# EAGLE design snarfbasev4b (EAGLE 6.4)
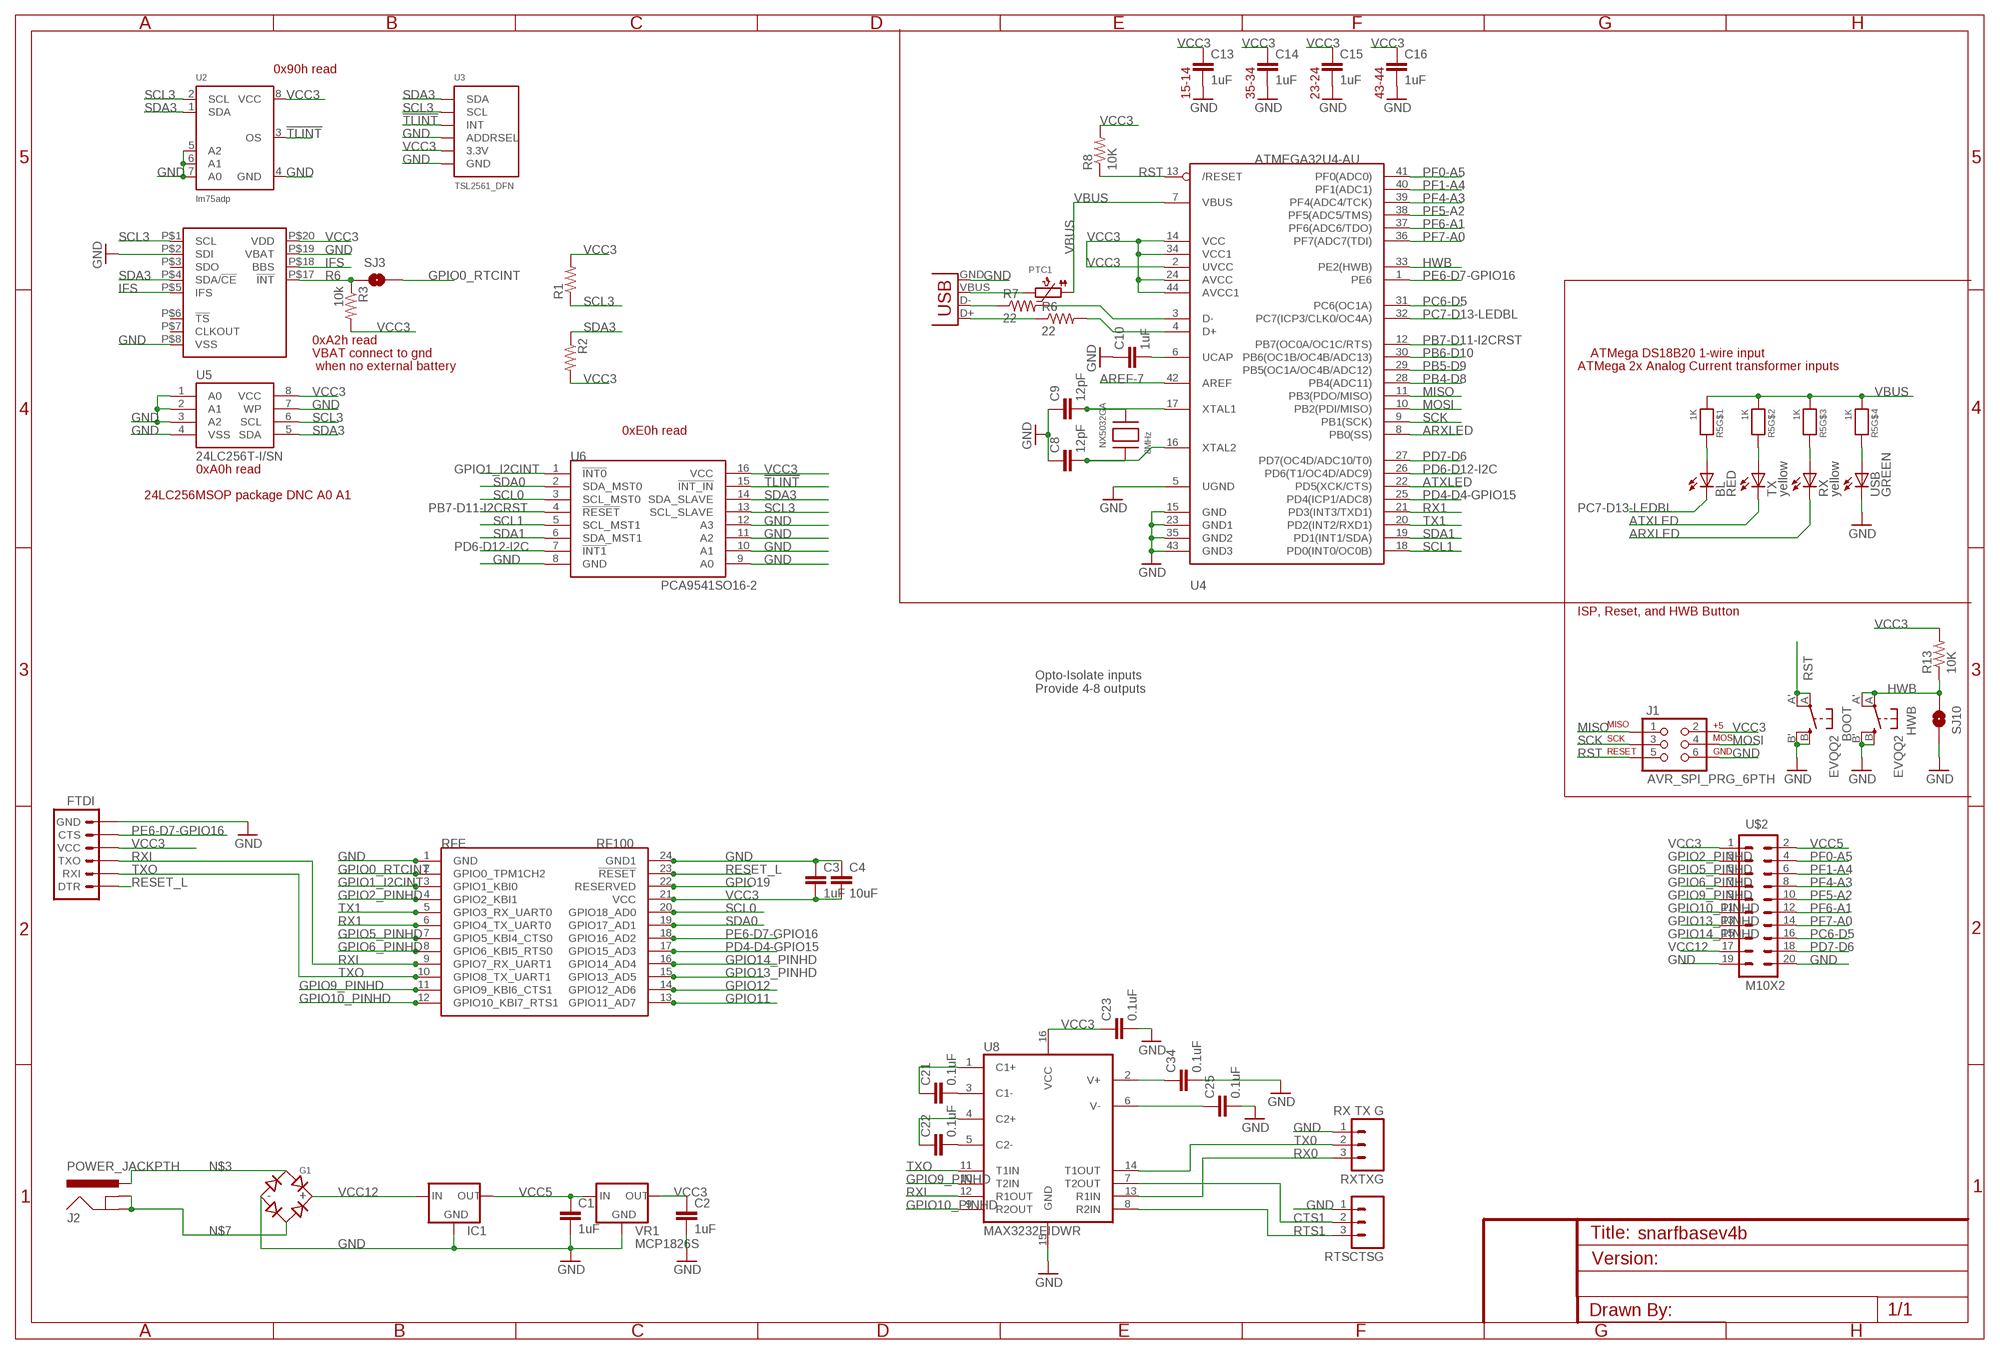
[diagram p0: schematic, sheet 1]

## Parts
BL  RED  LED0603  [LED-0603]
BOOT  EVQQ2  [EVQ-Q2]
C1  1uF  CAP0805  [0805]
C2  1uF  CAP0805  [0805]
C3  1uF  CAP0805  [0805]
C4  10uF  CAP0805  [0805]
C8  12pF  CAP0603-CAP  [0603-CAP]
C9  12pF  CAP0603-CAP  [0603-CAP]
C10  1uF  CAP0805  [0805]
C13  1uF  CAP0805  [0805]
C14  1uF  CAP0805  [0805]
C15  1uF  CAP0805  [0805]
C16  1uF  CAP0805  [0805]
C21  0.1uF  CAP0805  [0805]
C22  0.1uF  CAP0805  [0805]
C23  0.1uF  CAP0805  [0805]
C25  0.1uF  CAP0805  [0805]
C34  0.1uF  CAP0805  [0805]
FTDI  ARDUINO_SERIAL_PROGRAMPTH  [1X06]
G1  BRIDGERECTIFIER  [SOIC-4]
HWB  EVQQ2  [EVQ-Q2]
IC1  V_REG_78XXMURATA  [TO220-MURATA]
J1  AVR_SPI_PRG_6PTH  [2X3]
J2  POWER_JACKPTH  [POWER_JACK_PTH]
NX5032GA  8MHz  XTALNX5032  [NX5032]
PTC1  PTC1206  [1206]
R1  RESISTOR0805-RES  [0805]
R2  RESISTOR0805-RES  [0805]
R3  10k  RESISTOR  [0805]
R5  1K  RESISTOR_4PACK  [RESPACK_4X0603]
R6  22  RESISTOR0603-RES  [0603-RES]
R7  22  RESISTOR0603-RES  [0603-RES]
R8  10K  RESISTOR0805-RES  [0805]
R13  10K  RESISTOR0805-RES  [0805]
RFE  RFE  RF100-JACKJACK2  [SYNAPSERFENGINE-THM-SMT-JACK2]
RTSCTSG  M03PTH  [1X03]
RX  yellow  LED0603  [LED-0603]
RXTXG  RX TX G  M03PTH  [1X03]
SJ3  SOLDERJUMPERNC2  [SJ_2S-NOTRACE]
SJ10  HWB  SOLDERJUMPERNO  [SJ_2S-NO]
TX  yellow  LED0603  [LED-0603]
U1  PCF2129ASO20  [SO20W]
U2  lm75adp  TEMP_LM75B  [TSSOP8]
U3  TSL2561_DFN  LIGHT_TSL2561  [TSL2561_FN]
U4  ATMEGA32U4-AU  [TQFP44]
U5  24LC256T-I/SN  EEPROM-I2CSMD  [SO08]
U6  PCA9541SO16-2  [SOIC16]
U8  MAX3232EIDWR  MAX232SOIC16  [SO016]
U$2  M10X2  [2X10]
USB  GREEN  LED0603  [LED-0603]
VR1  MCP1826S  V_REG_MIC2920  [SOT223]
X1  USBSMD  USBH2959CT-ND  [USB-MINIB]

## Nets
!TLINT: U2.3(OS) U3.INT U6.15(!INT_IN)
AREF-7: U4.42(AREF)
ARXLED [smallsignal]: RX.C U4.8(PB0(SS))
ATXLED [smallsignal]: TX.C U4.22(PD5(XCK/CTS))
CTS1 [smallsignal]: RTSCTSG.2 U8.7(T2OUT)
GND: BOOT.B'(S1) BOOT.B(S) C1.2 C2.2 C3.1 C4.1 C8.1 C9.1 C10.1 C13.2 C14.2 C15.2 C16.2 C23.2 C25.2 C34.2 FTDI.6(GND) G1.- HWB.B'(S1) HWB.B(S) IC1.GND J1.6 RFE.1(GND) RFE.24(GND1) RFE.P1 RFE.P24 RFE.P201 RFE.P224 RTSCTSG.1 RXTXG.1 SJ10.2 U1.P$2(SDI) U1.P$8(VSS) U1.P$19(VBAT) U2.4(GND) U2.5(A2) U2.6(A1) U2.7(A0) U3.ADR(ADDRSEL) U3.VSS(GND) U4.5(UGND) U4.15(GND) U4.23(GND1) U4.35(GND2) U4.43(GND3) U5.1(A0) U5.2(A1) U5.3(A2) U5.4(VSS) U5.7(WP) U6.8(GND) U6.9(A0) U6.10(A1) U6.11(A2) U6.12(A3) U8.15(GND) U$2.19 U$2.20 USB.C VR1.2(GND) VR1.4(GND) X1.GND
GPIO0_RTCINT [smallsignal]: RFE.2(GPIO0_TPM1CH2) RFE.P2 RFE.P202 SJ3.2
GPIO1_I2CINT [smallsignal]: RFE.3(GPIO1_KBI0) RFE.P3 RFE.P203 U6.1(!INT0)
GPIO2_PINHD [smallsignal]: RFE.4(GPIO2_KBI1) RFE.P4 RFE.P204 U$2.3
GPIO5_PINHD [smallsignal]: RFE.7(GPIO5_KBI4_CTS0) RFE.P7 RFE.P207 U$2.5
GPIO6_PINHD [smallsignal]: RFE.8(GPIO6_KBI5_RTS0) RFE.P8 RFE.P208 U$2.7
GPIO9_PINHD: RFE.11(GPIO9_KBI6_CTS1) RFE.P11 RFE.P211 U8.10(T2IN) U$2.9
GPIO10_PINHD: RFE.12(GPIO10_KBI7_RTS1) RFE.P12 RFE.P212 U8.9(R2OUT) U$2.11
GPIO11 [smallsignal]: RFE.13(GPIO11_AD7) RFE.P13 RFE.P213
GPIO12 [smallsignal]: RFE.14(GPIO12_AD6) RFE.P14 RFE.P214
GPIO13_PINHD [smallsignal]: RFE.15(GPIO13_AD5) RFE.P15 RFE.P215 U$2.13
GPIO14_PINHD [smallsignal]: RFE.16(GPIO14_AD4) RFE.P16 RFE.P216 U$2.15
GPIO19: RFE.22(RESERVED) RFE.P22 RFE.P222
HWB [smallsignal]: HWB.A'(P1) HWB.A(P) R13.1 SJ10.1 U4.33(PE2(HWB))
IFS: U1.P$5(IFS) U1.P$18(BBS)
MISO [smallsignal]: J1.1 U4.11(PB3(PDO/MISO))
MOSI [smallsignal]: J1.4 U4.10(PB2(PDI/MISO))
N$3 [Power]: G1.~1(AC1) J2.PWR
N$4: C10.2 U4.6(UCAP)
N$5: BL.A R5.8
N$7 [Power]: G1.~2(AC2) J2.GND J2.GNDBREAK
N$8: R5.7 TX.A
N$9: R5.6 RX.A
N$10: R5.5 USB.A
N$13: C21.2 U8.3(C1-)
N$14: C22.2 U8.5(C2-)
N$15: C34.1 U8.2(V+)
N$16: C25.1 U8.6(V-)
N$17: C21.1 U8.1(C1+)
N$18: C22.1 U8.4(C2+)
PB4-D8 [smallsignal]: U4.28(PB4(ADC11))
PB5-D9 [smallsignal]: U4.29(PB5(OC1A/OC4B/ADC12))
PB6-D10 [smallsignal]: U4.30(PB6(OC1B/OC4B/ADC13))
PB7-D11-I2CRST [smallsignal]: U4.12(PB7(OC0A/OC1C/RTS)) U6.4(!RESET)
PC6-D5 [smallsignal]: U4.31(PC6(OC1A)) U$2.16
PC7-D13-LEDBL [smallsignal]: BL.C U4.32(PC7(ICP3/CLK0/OC4A))
PD4-D4-GPIO15 [smallsignal]: RFE.17(GPIO15_AD3) RFE.P17 RFE.P217 U4.25(PD4(ICP1/ADC8))
PD6-D12-I2C [smallsignal]: U4.26(PD6(T1/OC4D/ADC9)) U6.7(!INT1)
PD7-D6 [smallsignal]: U4.27(PD7(OC4D/ADC10/T0)) U$2.18
PE6-D7-GPIO16 [smallsignal]: FTDI.5(CTS) RFE.18(GPIO16_AD2) RFE.P18 RFE.P218 U4.1(PE6)
PF0-A5 [smallsignal]: U4.41(PF0(ADC0)) U$2.4
PF1-A4 [smallsignal]: U4.40(PF1(ADC1)) U$2.6
PF4-A3 [smallsignal]: U4.39(PF4(ADC4/TCK)) U$2.8
PF5-A2 [smallsignal]: U4.38(PF5(ADC5/TMS)) U$2.10
PF6-A1 [smallsignal]: U4.37(PF6(ADC6/TDO)) U$2.12
PF7-A0 [smallsignal]: U4.36(PF7(ADC7(TDI)) U$2.14
R6: R3.1 SJ3.1 U1.P$17(!INT)
RESET_L [smallsignal]: FTDI.1(DTR) RFE.23(!RESET) RFE.P23 RFE.P223
RST [smallsignal]: BOOT.A'(P1) BOOT.A(P) J1.5 R8.1 U4.13(/RESET)
RTS1 [smallsignal]: RTSCTSG.3 U8.8(R2IN)
RX0: RXTXG.3 U8.13(R1IN)
RX1 [smallsignal]: RFE.6(GPIO4_TX_UART0) RFE.P6 RFE.P206 U4.21(PD3(INT3/TXD1))
RXI [smallsignal]: FTDI.3(TXO) RFE.9(GPIO7_RX_UART1) RFE.P9 RFE.P209 U8.12(R1OUT)
SCK [smallsignal]: J1.3 U4.9(PB1(SCK))
SCL0: RFE.20(GPIO18_AD0) RFE.P20 RFE.P220 U6.3(SCL_MST0)
SCL1 [smallsignal]: U4.18(PD0(INT0/OC0B)) U6.5(SCL_MST1)
SCL3 [smallsignal]: R1.1 U1.P$1(SCL) U2.2(SCL) U3.CLK(SCL) U5.6(SCL) U6.13(SCL_SLAVE)
SDA0: RFE.19(GPIO17_AD1) RFE.P19 RFE.P219 U6.2(SDA_MST0)
SDA1 [smallsignal]: U4.19(PD1(INT1/SDA)) U6.6(SDA_MST1)
SDA3 [smallsignal]: R2.1 U1.P$4(SDA/!CE) U2.1(SDA) U3.DATA(SDA) U5.5(SDA) U6.14(SDA_SLAVE)
TX0: RXTXG.2 U8.14(T1OUT)
TX1 [smallsignal]: RFE.5(GPIO3_RX_UART0) RFE.P5 RFE.P205 U4.20(PD2(INT2/RXD1))
TXO [smallsignal]: FTDI.2(RXI) RFE.10(GPIO8_TX_UART1) RFE.P10 RFE.P210 U8.11(T1IN)
UD_N: R7.2 U4.3(D-)
UD_P: R6.2 U4.4(D+)
UDM_N: R7.1 X1.D-
UDM_P: R6.1 X1.D+
VBUS: PTC1.1 R5.1 R5.2 R5.3 R5.4 U4.7(VBUS)
VBUSRAW: PTC1.2 X1.VBUS
VCC3: C2.1 C3.2 C4.2 C13.1 C14.1 C15.1 C16.1 C23.1 FTDI.4(VCC) J1.2 R1.2 R2.2 R3.2 R8.2 R13.2 RFE.21(VCC) RFE.P21 RFE.P221 U1.P$20(VDD) U2.8(VCC) U3.VDD(3.3V) U4.2(UVCC) U4.14(VCC) U4.24(AVCC) U4.34(VCC1) U4.44(AVCC1) U5.8(VCC) U6.16(VCC) U8.16(VCC) U$2.1 VR1.3(OUT)
VCC5 [Power]: C1.1 IC1.OUT U$2.2 VR1.1(IN)
VCC12 [Power]: G1.+ IC1.IN U$2.17
XTAL_N [smallsignal]: C9.2 NX5032GA.P$2 U4.17(XTAL1)
XTAL_P [smallsignal]: C8.2 NX5032GA.P$1 U4.16(XTAL2)
Unconnected: U1.P$3(SDO) U1.P$6(!TS) U1.P$7(CLKOUT)

## Notes on the sheet
- 0x90h read
- 15-14 | 35-34 | 23-24 | 43-44
- 0xA2h read
- VBAT connect to gnd | ATMega DS18B20 1-wire input
- when no external battery | ATMega 2x Analog Current transformer inputs
- 0xE0h read
- 0xA0h read
- 24LC256MSOP package DNC A0 A1
- ISP, Reset, and HWB Button
- Opto-Isolate inputs
  Provide 4-8 outputs

## Library data of the parts
BL RX TX USB = 0_jc-custom:LED: LEDs Standard schematic elements and footprints for 5mm, 3mm, 1206, and 0603 sized LEDs. 5mm - Spark Fun Electronics SKU : COM-00529 (and others)
BOOT HWB = adaprog:EVQQ2
C1-C4 C10 C13-C16 C21-C23 C25 C34 = 0_jc-custom:CAP: Capacitor Standard 0603 ceramic capacitor, and 0.1" leaded capacitor.
C8 C9 = SparkFun:CAP: Capacitor Standard 0603 ceramic capacitor, and 0.1" leaded capacitor.
FTDI = SparkFun:ARDUINO_SERIAL_PROGRAM
G1 = microbuilder:BRIDGERECTIFIER: Bridge Rectifier SOIC-4: Comchip B4S-G - 400V 800mA, Peak Vf 1.1V (Digikey: 641-1334-1-ND)
IC1 = 0_jc-custom-eagle6:V_REG_78XX: Voltage Regulator Standard 7805 5V regulator. IGO (Input Ground Output). Spark Fun Electronics SKU : COM-00107
J1 = SparkFun:AVR_SPI_PRG_6: AVR ISP 6 Pin This is the reduced ISP connector for AVR programming. Common on Arduino. This footprint will take up less PCB space and can be used with a 10-pin to 6-pin adapter such as SKU: BOB-08508
J2 = SparkFun-Connectors:POWER_JACK: Power Jack This is the standard 5.5mm barrel jack for power. The PTH is the most common, proven, reliable, footprint. The Slot footprint only works if the mill layer is transmitted to the PCB fab house so be warned. Mating wall wart : TOL-00298 (and others); PROD_ID: PRT-00119
NX5032GA = adafruit:XTAL: Low cost SMT crystals, no capacitors included http://www.ladyada.net/library/eagle
PTC1 = microbuilder:PTC: PTC (Resettable Fuse) 1206 Package 250mA PTC (16V Max, Time-to-Trip: 0.08s) - Digikey: F2110CT-ND 1210 Package 100mA PTC (30V Max, Time-to-Trip: 0.6s) - Digikey: MF-USMF010-2CT-ND 1812 Package 750mA PTC (24V Max, Time-to-Trip: 0.2s) - Digikey: MF-MSMF075/24-2CT-ND
R1 R2 R8 R13 = SparkFun-Resistors:RESISTOR: Resistor
R3 = SparkFun:RESISTOR: Resistor
R5 = microbuilder:RESISTOR_4PACK: Resistor Packs (4 resistors) 4 x 0603 10K 1/16W - Digikey: YC164J-10KCT-ND
R6 R7 = 0_jc-custom:RESISTOR
RFE = 0_jc-custom:RF100-JACK
RTSCTSG RXTXG = SparkFun:M03: Header 3 Standard 3-pin 0.1" header. Use with straight break away headers (SKU : PRT-00116), right angle break away headers (PRT-00553), swiss pins (PRT-00743), machine pins (PRT-00117), and female headers (PRT-00115). Molex polarized connector foot print use with SKU : PRT-08232 with associated crimp pins and housings.
SJ3 SJ10 = SparkFun:SOLDERJUMPER: Solder Jumper Standard SMD solder jumper. Used to automate production. Two varients : Normally Open and Normally Closed are the same, but have different paste layers. NC will have a large amount of paste and should jumper during reflow.
U1 = 0_jc-custom:PCF2129A
U2 = microbuilder:TEMP_LM75B: LM75B I2C Temperature Sensor The I2C-based LM75B can measure temperature between -55 and 125°C in 0.125°C increments (11-bit resolution). Digikey: 568-4768-1-ND For a 1.8V compatible part, look at the following pin and SW compatible parts: DS75LV - Mouser: 700-DS75LVS, Digikey: (TSSOP8) DS75LVU+-ND (SOIC8) DS75LVS+-ND
U3 = microbuilder:LIGHT_TSL2561: TSL2561 Light-To-Digital Sensor Mouser Part Numbers: CS (obsolete): 856-TSL2561CS DFN (cheapest): 856-TSL2561FN
U4 = adafruit:ATMEGA32U4: http://www.ladyada.net/library/eagle
U5 = SparkFun:EEPROM-I2C
U6 = 0_jc-custom-eagle6:PCA9541
U8 = SparkFun:MAX232: RS232 Transceiver Very common IC. This is generically called 'MAX232', but works with the 3V equivalent MAX3232 generic ICs. Field tested and mother approved. Spark Fun Electronics SKU : COM-00316 (DIP) and COM-00589 (SMD)
U$2 = SparkFun-Connectors:M10X2: This was SPECIALLY designed to be used with our Graphic LCD Backpack. Be sure you want to use this! It is not only staggered on each line of header holes, but IT IS ALSO offset of the center point of the top and bottom lines by 5 mil. This causes the headers to lock into place on the "standard" footprint on the LCD screen. The extra squares on the tdocu layer are there simply to reference other pins (if you were to actually populate a longer header than ten long - this is what we do with the backpacks).
VR1 = SparkFun-PowerIC:V_REG_MIC2920: MIC2920A (http://www.micrel.com/_PDF/mic2920.pdf) - 400mA output LDO Regulator
X1 = 0_jc-custom:USB: USB Connectors Fully proven 670-1190-1-ND http://search.digikey.com/scripts/DkSearch/dksus.dll?Detail&name=670-1190-1-ND

## Net classes
0 default: width 0.254 mm
1 smallsignal: width 0.152 mm
2 Power: width 0.508 mm
3 medsignal: width 0.203 mm

## Board
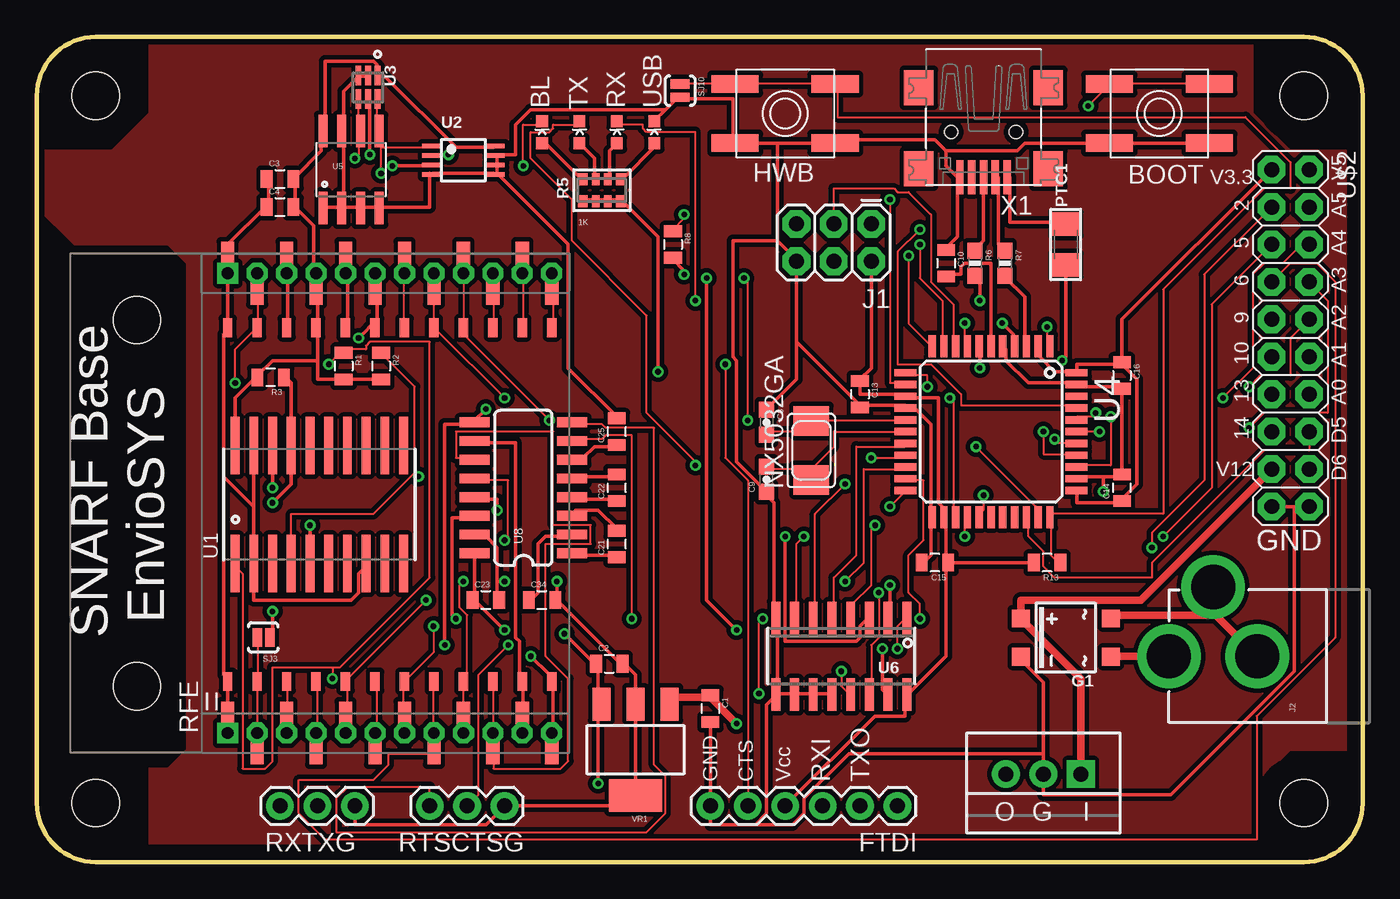
[diagram p1: board, top side]
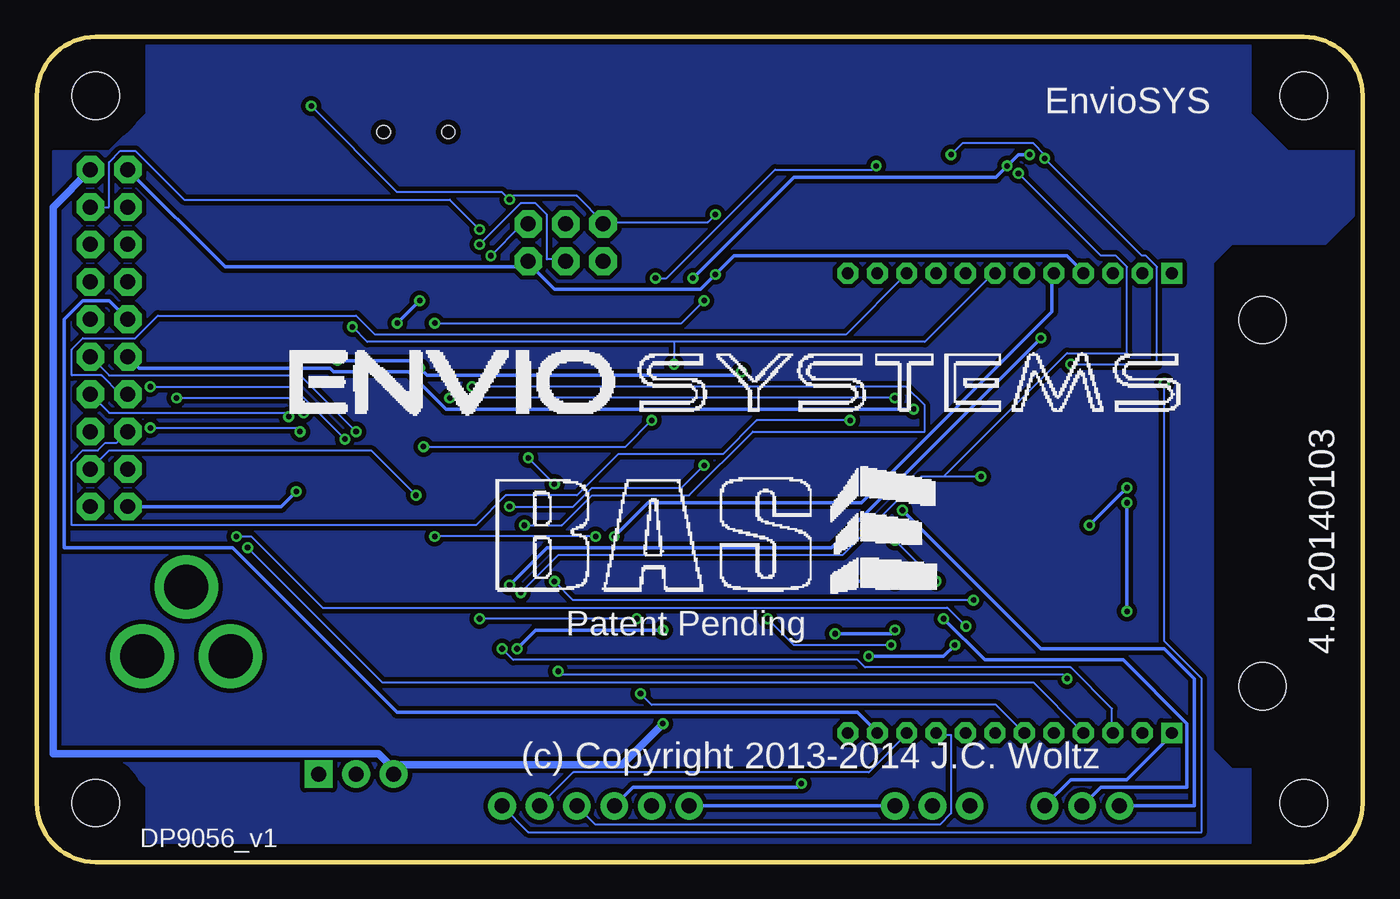
[diagram p2: board, bottom side, seen from below]

Size 90 x 56 mm. Coordinates in mm from the lower left corner, seen from the top.
Outline: 4,0 86,0 arc90 90,4 90,52 arc90 86,56 4,56 arc90 0,52 0,4 arc90 4,0
Copper layers (1*16): Top 0.0356mm / dielectric 1.5011mm / Bottom 0.0356mm
Design rules "LaenPCBOrder-JCModified *": minimum track width 6mil, minimum drill 15mil, track to track 6mil, track to pad 6mil, pad to pad 6mil, via to via 6mil, smd to smd 6mil, copper to edge 15mil, drill to drill 6mil, minimum pad ring 12mil, minimum via ring 7mil, stop-mask expansion 4mil, vias tented up to drill 25mil, thermal gap 10mil

### Footprints (pad centres in the part's own frame; a part is rotated, then mirrored left to right if it is on the bottom)
LED-0603 = smd 0.8 x 0.8: A 0,-0.75; C 0,0.75
EVQ-Q2 = smd 3.2 x 1.2: A -3.4,-2; A' 3.4,-2; B -3.4,2; B' 3.4,2
0805 = smd 0.8 x 1.2: 1 -0.9,0; 2 0.9,0
0603-CAP = smd 1.1 x 1: 1 -0.85,0; 2 0.85,0
1X06 = drill 1.016 pad 1.88: 1 0,0; 2 2.54,0; 3 5.08,0; 4 7.62,0; 5 10.16,0; 6 12.7,0
SOIC-4 = smd 1.2 x 1.2: + 1.3,3.05; - -1.3,3.05; ~1 -1.3,-3.05; ~2 1.3,-3.05
TO220-MURATA = drill 1 pad 1.88: GND 0,0; OUT 2.54,0 | drill 1 pad 1.88 square: IN -2.54,0
2X3 = drill 1.016 pad 1.88 octagon: 1 0,0; 2 0,2.54; 3 2.54,0; 4 2.54,2.54; 5 5.08,0; 6 5.08,2.54
POWER_JACK_PTH = drill 2.997 pad 4.318: GND 0,7.7; GNDBREAK 4.7,10.7; PWR 0,13.7
NX5032 = smd 2 x 2.4: P$1 2,0; P$2 -2,0
1206 = smd 1.6 x 1.8: 1 -1.4,0; 2 1.4,0
RESPACK_4X0603 = smd 0.65 x 0.8: 1 -1.3,-0.75; 4 1.3,-0.75; 5 1.3,0.75; 8 -1.3,0.75 | smd 0.5 x 0.8: 2 -0.4,-0.75; 3 0.4,-0.75; 6 0.4,0.75; 7 -0.4,0.75
0603-RES = smd 1.1 x 1: 1 -0.85,0; 2 0.85,0
SYNAPSERFENGINE-THM-SMT-JACK2 = drill 0.8 square: 1 0,0; 24 31.2,0 | drill 0.8 pad 1.422 octagon: 2 0,-2; 3 0,-4; 4 0,-6; 5 0,-8; 6 0,-10; 7 0,-12; 8 0,-14; 9 0,-16; 10 0,-18; 11 0,-20; 12 0,-22; 13 31.2,-22; 14 31.2,-20; 15 31.2,-18; 16 31.2,-16; 17 31.2,-14; 18 31.2,-12; 19 31.2,-10; 20 31.2,-8; 21 31.2,-6; 22 31.2,-4; 23 31.2,-2 | smd 1.67 x 0.89: P1 1.3,0; P2 -1.3,-2; P3 1.3,-4; P4 -1.3,-6; P5 1.3,-8; P6 -1.3,-10; P7 1.3,-12; P8 -1.3,-14; P9 1.3,-16; P10 -1.3,-18; P11 1.3,-20; P12 -1.3,-22; P13 29.9,-22; P14 32.5,-20; P15 29.9,-18; P16 32.5,-16; P17 29.9,-14; P18 32.5,-12; P19 29.9,-10; P20 32.5,-8; P21 29.9,-6; P22 32.5,-4; P23 29.9,-2; P24 32.5,0 | smd 1.27 x 0.635: P201 3.5,0; P202 3.5,-2; P203 3.5,-4; P204 3.5,-6; P205 3.5,-8; P206 3.5,-10; P207 3.5,-12; P208 3.5,-14; P209 3.5,-16; P210 3.5,-18; P211 3.5,-20; P212 3.5,-22; P213 27.5,-22; P214 27.5,-20; P215 27.5,-18; P216 27.5,-16; P217 27.5,-14; P218 27.5,-12; P219 27.5,-10; P220 27.5,-8; P221 27.5,-6; P222 27.5,-4; P223 27.5,-2; P224 27.5,0 | hole 3.2: 3.17,6.16; 28.03,6.16
1X03 = drill 1.016 pad 1.88: 1 0,0; 2 2.54,0; 3 5.08,0
SJ_2S-NOTRACE = smd 0.635 x 1.27: 1 -0.45,0; 2 0.4,0
SJ_2S-NO = smd 0.635 x 1.27: 1 -0.45,0; 2 0.45,0
SO20W = smd 0.6 x 3.9: P$1 -5.715,-4; P$2 -4.445,-4; P$3 -3.175,-4; P$4 -1.905,-4; P$5 -0.635,-4; P$6 0.635,-4; P$7 1.905,-4; P$8 3.175,-4; P$9 4.445,-4; P$10 5.715,-4; P$11 5.715,4; P$12 4.445,4; P$13 3.175,4; P$14 1.905,4; P$15 0.635,4; P$16 -0.635,4; P$17 -1.905,4; P$18 -3.175,4; P$19 -4.445,4; P$20 -5.715,4
TSSOP8 = smd 1.2 x 0.305: 1 -2.2,0.975; 2 -2.2,0.325; 3 -2.2,-0.325; 4 -2.2,-0.975; 5 2.2,-0.975; 6 2.2,-0.325; 7 2.2,0.325; 8 2.2,0.975
TSL2561_FN = smd 1.3 x 0.4: ADR -0.8,0; CLK 0.8,-0.65; DATA 0.8,0.65; INT 0.8,0; VDD -0.8,0.65; VSS -0.8,-0.65
TQFP44 = smd 1.5 x 0.5: 1 -5.8,4; 2 -5.8,3.2; 3 -5.8,2.4; 4 -5.8,1.6; 5 -5.8,0.8; 6 -5.8,0; 7 -5.8,-0.8; 8 -5.8,-1.6; 9 -5.8,-2.4; 10 -5.8,-3.2; 11 -5.8,-4; 23 5.8,-4; 24 5.8,-3.2; 25 5.8,-2.4; 26 5.8,-1.6; 27 5.8,-0.8; 28 5.8,0; 29 5.8,0.8; 30 5.8,1.6; 31 5.8,2.4; 32 5.8,3.2; 33 5.8,4 | smd 0.5 x 1.5: 12 -4,-5.8; 13 -3.2,-5.8; 14 -2.4,-5.8; 15 -1.6,-5.8; 16 -0.8,-5.8; 17 0,-5.8; 18 0.8,-5.8; 19 1.6,-5.8; 20 2.4,-5.8; 21 3.2,-5.8; 22 4,-5.8; 34 4,5.8; 35 3.2,5.8; 36 2.4,5.8; 37 1.6,5.8; 38 0.8,5.8; 39 0,5.8; 40 -0.8,5.8; 41 -1.6,5.8; 42 -2.4,5.8; 43 -3.2,5.8; 44 -4,5.8
SO08 = smd 0.61 x 2.21: 1 -1.905,-2.616; 2 -0.635,-2.616; 3 0.635,-2.616; 4 1.905,-2.616; 5 1.905,2.616; 6 0.635,2.616; 7 -0.635,2.616; 8 -1.905,2.616
SOIC16 = smd 0.6 x 2.2: 1 -4.445,-2.6; 2 -3.175,-2.6; 3 -1.905,-2.6; 4 -0.635,-2.6; 5 0.635,-2.6; 6 1.905,-2.6; 7 3.175,-2.6; 8 4.445,-2.6; 9 4.445,2.6; 10 3.175,2.6; 11 1.905,2.6; 12 0.635,2.6; 13 -0.635,2.6; 14 -1.905,2.6; 15 -3.175,2.6; 16 -4.445,2.6
SO016 = smd 0.66 x 2.032: 1 -4.445,-3.315; 2 -3.175,-3.315; 3 -1.905,-3.315; 4 -0.635,-3.315; 5 0.635,-3.315; 6 1.905,-3.315; 7 3.175,-3.315; 8 4.445,-3.315; 9 4.445,3.315; 10 3.175,3.315; 11 1.905,3.315; 12 0.635,3.315; 13 -0.635,3.315; 14 -1.905,3.315; 15 -3.175,3.315; 16 -4.445,3.315
2X10 = drill 1.016 pad 1.88 octagon: 1 -11.43,-1.27; 2 -11.43,1.27; 3 -8.89,-1.27; 4 -8.89,1.27; 5 -6.35,-1.27; 6 -6.35,1.27; 7 -3.81,-1.27; 8 -3.81,1.27; 9 -1.27,-1.27; 10 -1.27,1.27; 11 1.27,-1.27; 12 1.27,1.27; 13 3.81,-1.27; 14 3.81,1.27; 15 6.35,-1.27; 16 6.35,1.27; 17 8.89,-1.27; 18 8.89,1.27; 19 11.43,-1.27; 20 11.43,1.27
DP9056_V1 = hole 3.2: 4,4; 86,4; 86,52; 4,52
SOT223 = smd 1.219 x 2.235: 1 -2.311,-3.099; 2 0,-3.099; 3 2.311,-3.099 | smd 3.6 x 2.2: 4 0,3.099
USB-MINIB = smd 0.5 x 2.308: D+ 0,4.064; D- -0.8,4.064; GND 1.6,4.064; ID 0.8,4.064; VBUS -1.6,4.064 | smd 2 x 2.4: GND1 -4.4,-2; GND2 -4.4,3.5; GND3 4.4,3.5; GND4 4.4,-2 | hole 0.9: -2.2,1; 2.2,1

### Placement (x,y rotation side)
BL  34.29,49.53 0 top
BOOT  76.2,50.8 180 top
C1  45.72,10.41 270 top
C2  38.86,13.46 0 top
C3  16.51,46.35 0 top
C4  16.51,44.45 0 top
C8  49.53,29.84 270 top
C9  49.53,25.97 90 top
C10  61.72,40.64 270 top
C13  55.88,31.75 270 top
C14  73.66,25.4 90 top
C15  60.96,20.32 180 top
C16  73.66,33.02 270 top
C21  39.37,21.59 90 top
C22  39.37,25.4 90 top
C23  30.48,17.78 0 top
C25  39.37,29.21 90 top
C34  34.29,17.78 0 top
FTDI  58.42,3.81 180 top
G1  69.85,15.24 90 top
HWB  50.8,50.8 180 top
IC1  68.33,5.97 180 top
J1  56.64,43.31 180 top
J2  90.55,13.97 90 top
NX5032GA  52.58,27.94 90 top
PTC1  69.85,41.91 90 top
R1  20.83,33.66 270 top
R2  23.37,33.66 270 top
R3  15.88,32.89 180 top
R5  38.35,45.59 0 top
R6  63.68,40.64 270 top
R7  65.71,40.64 270 top
R8  43.18,41.91 270 top
R13  68.58,20.32 180 top
RFE  12.95,8.76 90 top
RTSCTSG  31.75,3.81 180 top
RX  39.37,49.53 0 top
RXTXG  21.59,3.81 180 top
SJ3  15.37,15.24 180 top
SJ10  43.66,52.35 270 top
TX  36.83,49.53 0 top
U1  19.18,24.26 0 top
U2  28.96,47.62 0 top
U3  22.48,52.58 270 top
U4  64.77,29.21 270 top
U5  21.34,46.99 0 top
U6  54.61,13.97 180 top
U8  33.02,25.4 90 top
U$1  [ENVIOSYS_LOGO2]  44.45,27.94 0 bottom
U$2  85.09,35.56 270 top
U$3  [DP9056_V1]  0,0 0 top
USB  41.91,49.53 0 top
VR1  40.64,7.62 180 top
X1  64.26,50.55 180 top

### Tracks (layer width: path | path; a pad name or v marks a point on that pad's centre or on a via)
!TLINT  (via drill 0.38)
  Top 0.254: v24.13,47.24 26.67,47.24 U2.3 | v22.61,48.01 22.61,51.56 U3.INT | v57.4,14.48 57.4,11.68 57.66,11.43 U6.15 | v47.5,15.75 45.47,17.78 v45.47,39.62
  Bottom 0.254: v22.61,48.01 23.37,48.01 v24.13,47.24 24.89,46.48 38.61,46.48 v45.47,39.62 | v57.4,14.48 56.13,15.75 v47.5,15.75
ARXLED  (via drill 0.38)
  Top 0.152: v44.7,38.1 44.7,49.53 41.4,49.53 41.15,49.78 41.15,50.04 39.37,50.04 RX.C | v62.99,36.58 62.99,35.05 U4.8
  Bottom 0.152: v44.7,38.1 46.23,36.58 v62.99,36.58
ATXLED  (via drill 0.38)
  Top 0.152: v44.7,26.92 44.7,27.18 41.4,30.48 41.4,37.08 36.32,42.16 36.32,44.96 33.53,47.75 33.53,49.53 34.8,49.53 35.05,49.78 35.05,50.04 36.83,50.04 TX.C | v57.91,24.13 58.93,25.15 U4.22
  Bottom 0.152: v44.7,26.92 46.23,25.4 52.32,25.4 53.59,24.13 v57.91,24.13
CTS1  (via drill 0.38)
  Top 0.152: v40.39,16.51 40.39,28.96 38.61,28.96 38.35,28.7 36.58,28.7 U8.7 | v32,14.73 29.97,12.7 29.97,4.57 RTSCTSG.2
  Bottom 0.152: v40.39,16.51 38.61,14.73 v32,14.73
GND  (via drill 0.38)
  Top 0.254: U5.1 19.56,44.45 20.57,44.45 U5.2 | 20.83,44.45 21.84,44.45 U5.3 22.1,44.45 23.11,44.45 U5.4 23.37,44.45 26.67,44.45 26.67,46.74 U2.4 26.92,46.74 30.99,46.74 U2.5 | 20.83,44.45 U5.2 | 21.84,53.34 22.35,53.34 U3.ADR | 21.84,53.34 U3.VSS 21.84,53.34 | 21.84,53.34 20.83,52.32 20.83,49.78 U5.7 20.83,49.53 20.83,44.45 | 20.83,44.45 U5.2 | 31.24,46.74 36.07,41.91 36.07,33.53 39.37,30.23 C25.2 | 31.24,46.74 U2.5 | 31.24,46.74 31.24,47.24 | 31.24,47.24 U2.6 31.24,47.24 | 31.24,46.74 U2.5 | 31.24,47.24 31.24,48.01 | 31.24,48.01 U2.7 31.24,48.01 | C15.2 60.2,20.32 60.71,20.83 60.71,23.37 U4.23 60.71,23.62 60.71,29.72 59.69,30.73 59.18,30.73 U4.15 58.93,30.99 55.88,30.99 | 55.88,30.99 C13.2 55.88,30.99 | 51.56,35.31 51.56,40.64 J1.6 51.56,40.89 50.29,42.16 | 51.56,35.31 51.56,32.77 49.53,30.73 C8.1 | 51.56,35.31 55.88,30.99 | BOOT.B 79.5,48.77 72.9,48.77 BOOT.B' 72.64,48.77 67.06,48.77 66.55,48.26 61.72,48.26 | 62.48,46.48 62.48,42.42 61.72,41.66 C10.1 | 62.48,46.48 X1.GND 62.48,46.48 | 42.67,51.05 43.43,51.82 SJ10.2 43.69,51.82 47.24,51.82 47.24,49.02 HWB.B' 47.5,48.77 50.29,48.77 | 42.67,51.05 41.91,50.29 USB.C | 50.29,48.77 54.1,48.77 HWB.B 54.36,49.02 60.96,49.02 61.72,48.26 | 62.48,46.48 61.72,47.24 61.72,48.26 | 50.29,48.77 50.29,42.16 | 31.24,48.01 32.51,48.01 32.51,50.04 33.53,51.05 42.67,51.05 | 72.39,26.16 70.61,26.16 U4.35 | 72.39,26.16 73.66,26.16 C14.2 73.66,26.42 73.66,32 C16.2 73.66,32.26 70.61,32.26 U4.43 70.36,32.51 67.31,32.51 65.79,34.04 65.79,34.8 U4.5 | U$2.20 85.34,24.13 | 85.34,24.13 U$2.19 | 68.33,7.37 68.33,6.1 IC1.GND 68.33,5.84 68.33,4.57 76.96,4.57 85.34,12.95 85.34,24.13
  Top 0.254: 68.33,7.37 68.33,12.19 66.8,13.72 G1.- | v72.39,25.15 72.39,26.16 | 50.29,11.43 51.31,11.43 U6.10 51.56,11.43 52.58,11.43 U6.11 52.83,11.43 53.85,11.43 U6.12 | 50.29,11.43 U6.9 | 50.29,11.43 50.29,16.51 U6.8 50.04,16.76 50.04,24.38 49.53,24.89 C9.1 49.53,25.15 47.5,27.18 47.5,34.04 47.24,34.29 47.24,42.16 50.29,42.16 | 50.29,11.43 U6.9 | C1.2 45.72,9.4 FTDI.6 45.72,2.54 48.77,2.54 | 31.24,19.05 31.24,21.34 30.48,22.1 29.72,22.1 U8.15 | 31.24,19.05 31.24,17.78 C23.2 | 35.31,17.78 39.62,13.46 C2.2 39.88,13.46 40.64,12.7 40.64,10.92 VR1.2 40.64,10.67 40.64,4.57 VR1.4 40.64,4.32 40.64,3.81 RTSCTSG.1 30.48,2.54 21.59,2.54 RXTXG.1 | 35.31,17.78 C34.2 35.31,17.78 | v31.75,19.05 31.24,19.05 | 35.31,17.78 v35.31,19.05 | 48.77,2.54 49.53,3.3 49.53,10.67 50.04,11.18 U6.9 | RFE.1 12.95,8.89 12.95,9.91 RFE.P1 12.95,10.16 12.95,12.19 RFE.P201 12.95,12.45 12.7,12.7 12.7,26.16 | C3.1 15.75,46.23 15.75,44.45 C4.1 15.49,44.45 12.95,41.91 12.95,41.4 RFE.P24 12.95,41.15 12.95,40.13 RFE.24 12.95,39.88 12.95,36.32 RFE.P224 12.95,36.07 12.7,35.81 12.7,26.16 | 14.73,24.13 14.73,28.19 U1.P$19 | 14.73,24.13 14.73,20.32 U1.P$2 14.73,20.07 14.73,17.78 21.34,17.78 21.84,18.29 21.84,19.56 22.35,20.07 U1.P$8 | 14.73,24.13 12.7,26.16 | 68.33,7.37 55.12,7.37 52.07,4.32 52.07,3.3 51.31,2.54 48.77,2.54
  Bottom 0.254: v72.39,25.15 73.41,24.13 U$2.19 | v35.31,19.05 v31.75,19.05 | RTSCTSG.1 FTDI.6 | RXTXG.1 19.81,5.59 16,5.59 12.95,8.64 RFE.1
GPIO0_RTCINT
  Top 0.152: SJ3.2 14.99,15.24 14.99,12.45 RFE.P202 14.99,12.19 14.99,8.89 RFE.2 14.99,8.64 14.99,7.62 RFE.P2
GPIO1_I2CINT  (via drill 0.38)
  Top 0.152: RFE.P203 17.02,12.19 17.02,10.16 RFE.P3 17.02,9.91 17.02,8.89 RFE.3 | v58.42,14.48 58.42,16 58.93,16.51 U6.1
  Bottom 0.152: v58.42,14.48 57.66,13.72 34.29,13.72 33.78,13.21 19.81,13.21 17.02,10.41 17.02,8.89 RFE.3
GPIO2_PINHD  (via drill 0.38)
  Top 0.152: RFE.P204 19.05,12.19 19.05,8.89 RFE.4 19.05,8.64 19.05,7.62 RFE.P4 | v75.69,21.34 75.69,22.35 79.25,25.91 79.25,39.88 U$2.3
  Bottom 0.152: v75.69,21.34 66.55,12.19 22.35,12.19 19.05,8.89 RFE.4
GPIO5_PINHD  (via drill 0.38)
  Top 0.152: RFE.7 24.89,8.89 24.89,9.91 RFE.P7 24.89,10.16 24.89,12.19 RFE.P207 25.15,12.45 26.92,14.22 v26.92,16 | v76.45,22.1 79.76,25.4 79.76,37.85 U$2.5
  Bottom 0.152: v26.92,16 28.19,17.27 70.61,17.27 75.44,22.1 v76.45,22.1
GPIO6_PINHD
  Top 0.152: RFE.P208 26.92,12.19 26.92,8.89 RFE.8 26.92,8.64 26.92,7.62 RFE.P8 26.92,7.37 23.88,7.37 23.88,6.6 22.86,5.59 17.78,5.59 17.78,3.3 19.56,1.52 82.8,1.52 82.8,9.91 88.14,15.24 88.14,39.37 86.87,40.64 85.09,40.64 U$2.7
GPIO9_PINHD
  Top 0.254: U8.10 29.72,28.45 32.51,28.45 32.51,15.24 32.77,14.99 32.77,12.45 RFE.P211 33.02,12.19 33.02,10.16 RFE.P11 33.02,9.91 33.02,8.89 RFE.11
  Bottom 0.254: U$2.9 85.09,38.1 86.87,38.1 88.14,36.83 88.14,21.34 76.71,21.34 65.53,10.16 34.29,10.16 33.02,8.89 RFE.11
GPIO10_PINHD  (via drill 0.38)
  Top 0.254: RFE.P12 35.05,7.62 35.05,8.64 RFE.12 35.05,8.89 35.05,12.19 RFE.P212 34.8,12.45 34.8,12.7 v33.53,13.97 | v27.69,14.73 27.69,29.72 29.46,29.72 U8.9 29.72,29.97 v30.48,30.73
  Bottom 0.254: v27.69,14.73 28.45,13.97 v33.53,13.97 | U$2.11 83.06,33.53 70.1,33.53 69.85,33.27 64.77,33.27 62.23,30.73 v30.48,30.73
GPIO11
  Top 0.152: RFE.P213 35.05,36.32 35.05,38.61 RFE.P13 35.05,38.86 35.05,39.88 RFE.13
GPIO12
  Top 0.152: RFE.P214 33.02,36.32 33.02,39.88 RFE.14 33.02,40.13 33.02,41.15 RFE.P14
GPIO13_PINHD
  Top 0.152: RFE.P215 30.99,36.32 30.99,38.61 RFE.P15 30.99,38.86 30.99,39.88 RFE.15
  Bottom 0.152: U$2.13 84.33,31.75 85.6,33.02 87.63,33.02 87.63,34.8 86.87,35.56 83.31,35.56 81.79,37.08 68.33,37.08 67.06,35.81 35.05,35.81 30.99,39.88 RFE.15
GPIO14_PINHD  (via drill 0.38)
  Top 0.152: RFE.P16 28.96,41.15 28.96,40.13 RFE.16 28.96,39.88 28.96,36.32 RFE.P216 28.96,36.07 28.96,35.81 v34.8,29.97
  Bottom 0.152: U$2.15 84.58,28.45 85.34,28.45 85.85,27.94 86.87,27.94 87.63,27.18 87.63,22.86 60.2,22.86 58.17,24.89 53.34,24.89 50.55,27.69 43.43,27.69 41.15,29.97 v34.8,29.97
GPIO19
  Top 0.254: RFE.P222 17.02,36.32 17.02,39.88 RFE.22 17.02,40.13 17.02,41.15 RFE.P22
HWB
  Top 0.152: SJ10.1 43.69,52.83 47.24,52.83 HWB.A' 47.5,52.83 54.1,52.83 HWB.A 54.36,52.58 54.36,50.55 82.04,50.55 85.09,47.5 85.09,45.72 83.31,45.72 76.45,38.86 76.45,23.62 68.83,23.62 U4.33 68.83,23.37 68.83,20.83 69.34,20.32 R13.1
IFS  (via drill 0.38)
  Top 0.254: v18.54,22.86 18.54,20.32 U1.P$5 | v16,25.4 16,28.19 U1.P$18
  Bottom 0.254: v16,25.4 v18.54,22.86
MISO  (via drill 0.38)
  Top 0.152: v59.18,41.15 59.18,36.58 60.71,35.05 U4.11
  Bottom 0.152: v59.18,41.15 57.15,43.18 56.64,43.18 J1.1
MOSI  (via drill 0.38)
  Top 0.152: v59.94,41.91 59.94,39.62 61.47,38.1 61.47,35.05 U4.10
  Bottom 0.152: v59.94,41.91 57.15,44.7 56.13,44.7 55.37,43.94 55.37,40.89 54.1,40.89 J1.4
N$2
  pour Top (isolate 0.305): 7.62,55.88 7.62,50.8 5.08,48.26 0,48.26 0,44.45 2.54,41.91 8.89,41.91 10.16,40.64 10.16,7.62 8.89,6.35 7.62,6.35 7.62,1.27 82.55,1.27 82.55,5.08 85.09,7.62 88.9,7.62 88.9,48.26 85.09,48.26 82.55,50.8 82.55,55.88
N$3
  Top 0.508: G1.~1 73.15,13.97 76.71,13.97 J2.PWR
N$4
  Top 0.254: C10.2 61.72,39.88 62.74,39.88 62.74,40.39 62.99,40.64 64.77,40.64 64.77,35.05 U4.6
N$5
  Top 0.254: R5.8 36.83,46.48 34.29,49.02 BL.A
N$7
  Top 0.508: 79.76,17.02 79.76,18.54 J2.GNDBREAK 79.76,17.02 | 79.76,17.02 79.76,16.76 73.15,16.76 G1.~2 | 79.76,17.02 82.8,13.97 J2.GND
N$8
  Top 0.254: R5.7 37.85,46.48 37.85,47.75 36.83,48.77 TX.A
N$9
  Top 0.254: R5.6 38.86,46.48 38.86,48.26 39.37,48.77 RX.A
N$10
  Top 0.254: R5.5 39.88,46.48 41.91,48.51 41.91,48.77 USB.A
N$12
  pour Bottom (isolate 0.305): 7.62,55.88 7.62,50.8 5.08,48.26 0,48.26 0,44.45 2.54,41.91 8.89,41.91 10.16,40.64 10.16,7.62 8.89,6.35 7.62,6.35 7.62,1.27 82.55,1.27 82.55,5.08 85.09,7.62 88.9,7.62 88.9,48.26 85.09,48.26 82.55,50.8 82.55,55.88
N$13
  Top 0.254: C21.2 39.37,22.61 38.1,23.88 36.58,23.88 36.58,23.62 U8.3
N$14
  Top 0.254: C22.2 39.37,26.16 36.58,26.16 U8.5
N$15
  Top 0.254: C34.1 33.53,17.78 34.04,18.29 34.04,21.59 34.54,22.1 36.32,22.1 U8.2
N$16
  Top 0.254: C25.1 39.37,28.19 37.85,28.19 37.08,27.43 36.58,27.43 U8.6
N$17
  Top 0.254: C21.1 39.37,20.83 36.58,20.83 U8.1
N$18
  Top 0.254: C22.1 39.37,24.64 36.58,24.64 U8.4
PB7-D11-I2CRST  (via drill 0.38)
  Top 0.152: v60.45,32.26 60.45,33.02 59.18,33.02 U4.12 | v56.9,22.86 56.64,22.61 56.64,18.8 55.37,17.53 55.37,16.76 U6.4
  Bottom 0.152: v60.45,32.26 30.99,32.26 29.72,30.99 29.72,29.21 41.4,29.21 45.72,24.89 52.32,24.89 54.36,22.86 v56.9,22.86
PC6-D5
  Top 0.152: U$2.16 86.36,27.94 83.31,27.94 75.69,20.32 75.69,19.3 69.09,19.3 68.33,20.07 68.33,21.08 67.31,22.1 67.31,23.37 U4.31
PC7-D13-LEDBL  (via drill 0.38)
  Top 0.152: v33.02,47.24 33.02,50.04 34.29,50.04 BL.C | v48.01,39.62 48.26,39.37 v48.26,29.97 | v63.75,28.19 67.82,24.13 67.82,23.62 U4.32
  Bottom 0.152: v33.02,47.24 33.27,46.99 39.88,46.99 47.24,39.62 v48.01,39.62 | v48.26,29.97 50.04,28.19 v63.75,28.19
PD4-D4-GPIO15  (via drill 0.38)
  Top 0.152: v61.98,31.5 62.23,31.24 62.23,23.62 U4.25 | v31.75,31.5 27.18,36.07 RFE.P217 26.92,36.32 26.92,38.61 RFE.P17 26.92,38.86 26.92,39.88 RFE.17
  Bottom 0.152: v31.75,31.5 v61.98,31.5
PD6-D12-I2C  (via drill 0.38)
  Top 0.152: v62.99,22.1 62.99,23.37 U4.26 | v52.07,22.1 51.56,21.59 51.56,16.76 U6.7
  Bottom 0.152: v52.07,22.1 v62.99,22.1
PD7-D6  (via drill 0.38)
  Top 0.152: v64.26,24.89 64.26,23.88 64.01,23.62 U4.27
  Bottom 0.152: v64.26,24.89 67.31,27.94 85.09,27.94 U$2.18
PE6-D7-GPIO16  (via drill 0.38)
  Top 0.152: RFE.P218 24.89,36.32 24.89,39.88 RFE.18 24.89,40.13 24.89,41.15 RFE.P18 | v68.58,36.32 68.58,35.05 U4.1 | FTDI.5 48.26,25.91 46.74,27.43 v46.74,33.78
  Bottom 0.152: v68.58,36.32 67.56,35.31 46.74,35.31 | 46.74,35.31 29.72,35.31 25.15,39.88 RFE.18 | 46.74,35.31 v46.74,33.78
PF0-A5  (via drill 0.38)
  Top 0.152: v59.94,42.93 58.42,41.4 58.42,33.78 60.71,33.78 62.74,31.75 62.74,30.99 70.36,30.99 U4.41
  Bottom 0.152: v59.94,42.93 61.98,44.96 80.01,44.96 83.31,48.26 84.33,48.26 85.09,47.5 85.09,44.45 U$2.4
PF1-A4  (via drill 0.38)
  Top 0.152: v71.88,30.48 71.88,30.23 70.61,30.23 U4.40 | v80.52,31.5 82.55,33.53 82.55,39.88 83.31,40.64 84.58,40.64 85.85,41.91 U$2.6
  Bottom 0.152: v71.88,30.48 72.9,31.5 v80.52,31.5
PF4-A3  (via drill 0.38)
  Top 0.152: v72.14,29.21 70.61,29.21 U4.39 | v82.3,29.46 83.31,30.48 87.63,30.48 87.63,38.1 U$2.8
  Bottom 0.152: v72.14,29.21 72.39,29.46 v82.3,29.46
PF5-A2  (via drill 0.38)
  Top 0.152: v69.09,28.7 69.09,28.45 70.36,28.45 U4.38 | v82.3,32.26 83.06,33.02 85.09,33.02 85.09,35.56 U$2.10
  Bottom 0.152: v69.09,28.7 72.64,32.26 v82.3,32.26
PF6-A1  (via drill 0.38)
  Top 0.152: v68.33,29.21 68.33,27.69 70.36,27.69 U4.37
  Bottom 0.152: v68.33,29.21 72.14,33.02 85.09,33.02 U$2.12
PF7-A0  (via drill 0.38)
  Top 0.152: v72.9,30.23 72.9,26.92 70.61,26.92 U4.36
  Bottom 0.152: v72.9,30.23 73.15,30.48 85.09,30.48 U$2.14
R6  (via drill 0.38)
  Top 0.254: R3.1 17.02,32.77 17.27,32.51 17.27,28.45 U1.P$17 17.27,28.19 17.27,25.65 v16,24.38 | v16,17.02 16,15.24 SJ3.1
  Bottom 0.254: v16,24.38 v16,17.02
RESET_L  (via drill 0.38)
  Top 0.152: RFE.23 14.99,39.88 14.99,38.86 RFE.P23 14.99,38.61 14.99,36.32 RFE.P223 14.73,36.07 13.46,34.8 v13.46,32.51
  Bottom 0.152: v13.46,32.51 13.46,14.99 10.92,12.45 10.92,2.03 56.64,2.03 FTDI.1
RST  (via drill 0.38)
  Top 0.152: BOOT.A 79.5,52.83 72.9,52.83 BOOT.A' 72.64,52.58 v71.37,51.31 | v43.94,43.94 43.94,43.69 43.18,42.93 R8.1 | v57.91,44.96 57.91,32.51 58.93,32.51 U4.13
  Bottom 0.152: v43.94,43.94 44.45,43.43 51.56,43.43 | 51.56,43.43 J1.5 51.56,43.43 | 51.56,43.43 53.34,45.21 57.66,45.21 v57.91,44.96 58.42,45.47 65.53,45.47 v71.37,51.31
RTS1
  Top 0.152: RTSCTSG.3 26.67,5.08 21.08,5.08 20.32,4.32 20.32,2.03 41.4,2.03 42.67,3.3 42.67,5.84 41.91,6.6 41.91,29.46 38.61,29.46 38.35,29.72 36.58,29.72 U8.8
RX0  (via drill 0.38)
  Top 0.254: v31.24,23.88 31.24,24.64 29.72,24.64 U8.13
  Bottom 0.254: v31.24,23.88 21.84,14.48 13.46,14.48 11.43,12.45 11.43,3.81 RXTXG.3
RX1  (via drill 0.38)
  Top 0.152: RFE.P206 23.11,12.19 23.11,8.89 RFE.6 23.11,8.64 23.11,7.62 RFE.P6 | v59.94,16.51 59.94,17.53 59.18,18.29 59.18,20.83 60.2,21.84 60.2,25.91 59.18,25.91 U4.21 | v49.28,16.51 49.02,16.26 v49.02,11.43
  Bottom 0.152: v49.28,16.51 v59.94,16.51 | v49.02,11.43 48.26,10.67 24.89,10.67 23.11,8.89 RFE.6
RXI  (via drill 0.38)
  Top 0.152: v31.75,21.84 32,22.1 32,25.91 29.72,25.91 U8.12 | v28.96,19.05 28.7,18.8 28.7,17.27 29.21,16.76 29.21,12.7 28.96,12.45 RFE.P209 28.96,12.19 28.96,10.16 RFE.P9 28.96,9.91 28.96,8.89 RFE.9
  Bottom 0.152: v28.96,19.05 v31.75,21.84 | FTDI.3 52.07,2.54 28.7,2.54 27.94,3.3 27.94,8.64 28.7,8.64 RFE.9
SCK
  Top 0.152: U4.9 62.23,35.05 62.23,37.85 60.71,39.37 60.71,43.94 59.18,45.47 58.42,45.47 58.17,45.72 54.1,45.72 54.1,43.43 J1.3
SCL0  (via drill 0.38)
  Top 0.254: RFE.P220 21.08,36.32 21.08,39.88 RFE.20 21.08,40.13 21.08,41.15 RFE.P20 | v50.8,22.1 50.8,14.99 55.63,14.99 55.88,15.24 55.88,16 56.39,16.51 U6.3
  Bottom 0.254: v50.8,22.1 48.51,24.38 34.04,24.38 21.08,37.34 21.08,39.88 RFE.20
SCL1
  Top 0.152: U4.18 58.93,28.19 55.63,28.19 55.63,20.83 54.1,19.3 54.1,16.76 U6.5
SCL3  (via drill 0.38)
  Top 0.152: v27.94,48.01 26.92,48.01 U2.2 | v21.59,47.75 21.84,48.01 21.84,49.53 U5.6 21.84,49.78 21.84,51.56 U3.CLK | 20.83,34.8 22.35,34.8 22.35,35.05 22.61,35.31 26.67,35.31 26.67,19.3 20.57,13.21 20.07,13.21 | 20.07,13.21 16,13.21 16,6.86 15.49,6.35 13.97,6.35 13.97,19.56 13.46,20.07 U1.P$1 | 20.83,34.8 R1.1 20.83,34.8 | v54.61,12.95 54.61,11.94 55.12,11.43 U6.13 | 20.07,13.21 v20.07,12.45 | 20.83,34.8 v19.81,33.78
  Bottom 0.152: v27.94,48.01 27.18,48.77 22.35,48.77 21.59,48.01 v21.59,47.75 14.99,41.15 14.73,41.15 13.97,40.39 13.97,33.78 v19.81,33.78 | v54.61,12.95 54.36,12.7 20.32,12.7 v20.07,12.45
SDA0  (via drill 0.38)
  Top 0.254: 23.11,36.83 23.11,38.61 RFE.P19 23.11,38.86 23.11,39.88 RFE.19 | 23.11,36.83 23.11,36.32 RFE.P219 23.11,36.83 | v57.91,18.8 57.91,16.76 U6.2 | 23.11,36.83 v21.84,35.56
  Bottom 0.254: v57.91,18.8 55.37,21.34 36.07,21.34 v21.84,35.56
SDA1  (via drill 0.38)
  Top 0.152: v56.64,27.43 58.93,27.43 U4.19 | v54.86,25.65 52.83,23.62 52.83,16.76 U6.6
  Bottom 0.152: v54.86,25.65 v56.64,27.43
SDA3  (via drill 0.38)
  Top 0.152: 23.37,48.51 26.67,48.51 U2.1 | 23.37,48.51 23.37,49.53 U5.5 | U3.DATA 23.11,51.56 23.11,49.78 U5.5 | 25.65,26.42 25.65,32.26 R2.1 | 25.65,26.42 22.86,23.62 17.27,23.62 17.27,20.32 U1.P$4 | v57.15,18.29 57.15,15.24 56.64,14.73 56.64,11.43 U6.14 | 25.65,26.42 v25.91,26.16 | v23.37,46.74 23.37,48.51 | 23.37,48.51 U5.5
  Bottom 0.152: v57.15,18.29 54.61,20.83 35.31,20.83 29.97,26.16 28.45,26.16 | v25.91,26.16 28.45,26.16 | v23.37,46.74 17.78,41.15 16.76,41.15 16,40.39 16,34.54 20.07,34.54 28.45,26.16
TX0  (via drill 0.38)
  Top 0.254: v28.45,16.51 28.19,16.76 28.19,23.37 29.46,23.37 U8.14
  Bottom 0.254: v28.45,16.51 25.65,13.72 16.26,13.72 11.94,9.4 11.94,5.08 17.78,5.08 RXTXG.2
TX1  (via drill 0.38)
  Top 0.152: v54.86,19.05 56.13,20.32 56.13,26.67 58.93,26.67 U4.20 | v26.42,17.78 21.08,12.45 RFE.P205 21.08,12.19 21.08,10.16 RFE.P5 21.08,9.91 21.08,8.89 RFE.5
  Bottom 0.152: v54.86,19.05 53.59,17.78 v26.42,17.78
TXO
  Top 0.152: RFE.P210 30.99,12.19 30.99,8.89 RFE.10 30.99,8.64 30.99,7.62 RFE.P10 30.99,7.37 30.99,6.35 35.56,6.35 36.07,6.86 36.07,12.45 34.54,13.97 34.54,21.59 37.59,21.59 37.59,22.86 35.05,22.86 35.05,29.21 28.45,29.21 28.45,27.43 29.46,27.43 U8.11
  Bottom 0.152: FTDI.2 53.59,6.1 33.53,6.1 30.99,8.64 RFE.10
UD_N
  Top 0.254: R7.2 65.79,39.62 67.06,38.35 67.06,35.05 U4.3
UD_P  (via drill 0.38)
  Top 0.254: v64.01,38.1 64.01,39.37 63.75,39.62 R6.2 | v65.53,36.58 66.29,35.81 66.29,35.05 U4.4
  Bottom 0.254: v65.53,36.58 v64.01,38.1
UDM_N
  Top 0.254: R7.1 65.53,41.66 65.28,41.91 65.28,46.48 X1.D-
UDM_P
  Top 0.254: X1.D+ 64.26,42.16 63.75,41.66 R6.1
VBUS  (via drill 0.38)
  Top 0.254: R5.1 37.08,44.96 37.85,44.96 R5.2 38.1,44.96 38.61,44.96 R5.3 38.86,44.96 39.62,44.96 R5.4 39.88,44.7 42.16,42.42 v42.16,33.27 | v64.01,33.53 64.01,34.8 U4.7 | v69.6,34.04 69.85,34.29 69.85,40.39 PTC1.1
  Bottom 0.254: v69.6,34.04 64.52,34.04 v64.01,33.53 63.5,33.02 42.42,33.02 v42.16,33.27
VBUSRAW
  Top 0.254: PTC1.2 69.85,43.43 66.04,43.43 66.04,46.48 X1.VBUS
VCC3  (via drill 0.38)
  Top 0.254: U2.8 30.99,48.51 28.45,48.51 23.62,53.34 23.11,53.34 U3.VDD 23.11,53.59 23.11,54.1 22.86,54.36 19.56,54.36 19.56,49.78 U5.8 19.3,49.53 19.3,48.26 17.53,46.48 C3.2 17.53,46.23 17.53,44.45 | U1.P$20 13.46,28.45 13.46,31.5 14.73,32.77 R3.2 14.99,33.02 16,34.04 19.05,34.04 | 17.53,44.45 C4.2 17.53,44.45 | R1.2 R2.2 | R1.2 | R1.2 19.05,32.77 19.05,34.04 | 19.05,34.04 19.05,36.07 RFE.P221 19.05,36.32 19.05,38.61 RFE.P21 19.05,38.86 19.05,39.88 RFE.21 18.8,40.13 18.8,43.18 17.53,44.45 | U4.34 70.61,25.15 70.61,24.38 73.66,24.38 C14.1 73.66,24.64 74.68,25.65 74.68,32.77 73.66,33.78 | 73.66,33.78 70.61,33.78 70.61,33.27 U4.44 70.36,33.27 69.09,33.27 68.07,34.29 68.07,34.8 U4.2 | 73.66,33.78 C16.1 | 73.66,33.78 C16.1 | U$2.1 73.66,36.83 73.66,34.04 C16.1 | v43.94,39.88 43.94,40.13 43.18,40.89 R8.2 | J1.2 56.64,40.64 56.64,33.53 55.88,32.77 C13.1 55.88,32.51 55.88,31.75 58.93,31.75 U4.14 59.18,31.5 61.21,31.5 61.21,24.38 61.47,24.13 61.47,23.62 U4.24 61.72,23.37 61.72,20.32 | 29.72,17.78 29.72,20.83 U8.16 | 29.72,17.78 C23.1 29.72,17.78 | v31.75,15.75 29.72,17.78 | v35.81,15.49 37.85,13.46 C2.1 38.1,13.46 38.1,10.92 VR1.3 38.1,10.67 v38.1,5.33 | 61.72,20.32 C15.1 | R13.2 67.56,20.32 61.98,20.32 C15.1 | 61.72,20.32 61.72,13.97 59.18,11.43 U6.16 58.93,11.18 58.93,9.91 56.9,9.91 FTDI.4 | 61.72,20.32 C15.1
  Bottom 0.254: 56.39,40.39 56.64,40.64 J1.2 56.39,40.39 | 56.39,40.39 54.86,38.86 44.96,38.86 v43.94,39.88 42.67,41.15 20.07,41.15 19.05,40.13 RFE.21 | v31.75,15.75 32,15.49 v35.81,15.49 | v38.1,5.33 38.35,5.08 49.53,5.08 FTDI.4 | U$2.1 77.22,40.39 56.39,40.39
VCC5  (via drill 0.38)
  Top 0.508: 45.72,11.18 43.18,11.18 43.18,10.92 VR1.1 | 45.72,11.18 C1.1 45.72,11.18 | v47.5,9.4 45.72,11.18
  Bottom 0.508: v47.5,9.4 50.29,6.6 65.28,6.6 65.79,6.1 IC1.OUT 65.79,6.35 66.8,7.37 88.9,7.37 88.9,44.45 U$2.2
VCC12
  Top 0.508: IC1.IN 70.87,6.1 70.87,12.45 66.8,16.51 G1.+ 66.8,16.76 66.8,17.78 74.93,17.78 U$2.17
XTAL_N
  Top 0.152: 52.58,26.67 49.53,26.67 C9.2 | 52.58,26.67 52.58,26.16 NX5032GA.P$2 52.58,26.67 | 52.58,26.67 54.1,28.19 54.1,29.21 58.93,29.21 U4.17
XTAL_P
  Top 0.152: C8.2 49.53,29.21 52.58,29.21 52.58,29.72 NX5032GA.P$1 52.58,29.97 58.93,29.97 U4.16

### Text on the board
tPlace: V5 | V3.3 | 2 | A5 | A4 | 5 | 6 | A3 | A2 | 9 | 10 | A1 | 13 | A0 | 14 | D5 | D6 | V12 | GND | SNARF Base / EnvioSYS | = | GND | CTS | Vcc | RXI | TXO
bPlace: EnvioSYS | 4.b 20140103 | (c) Copyright 2013-2014 J.C. Woltz